# Altium schematic sheet Sheet7.SchDoc
size A
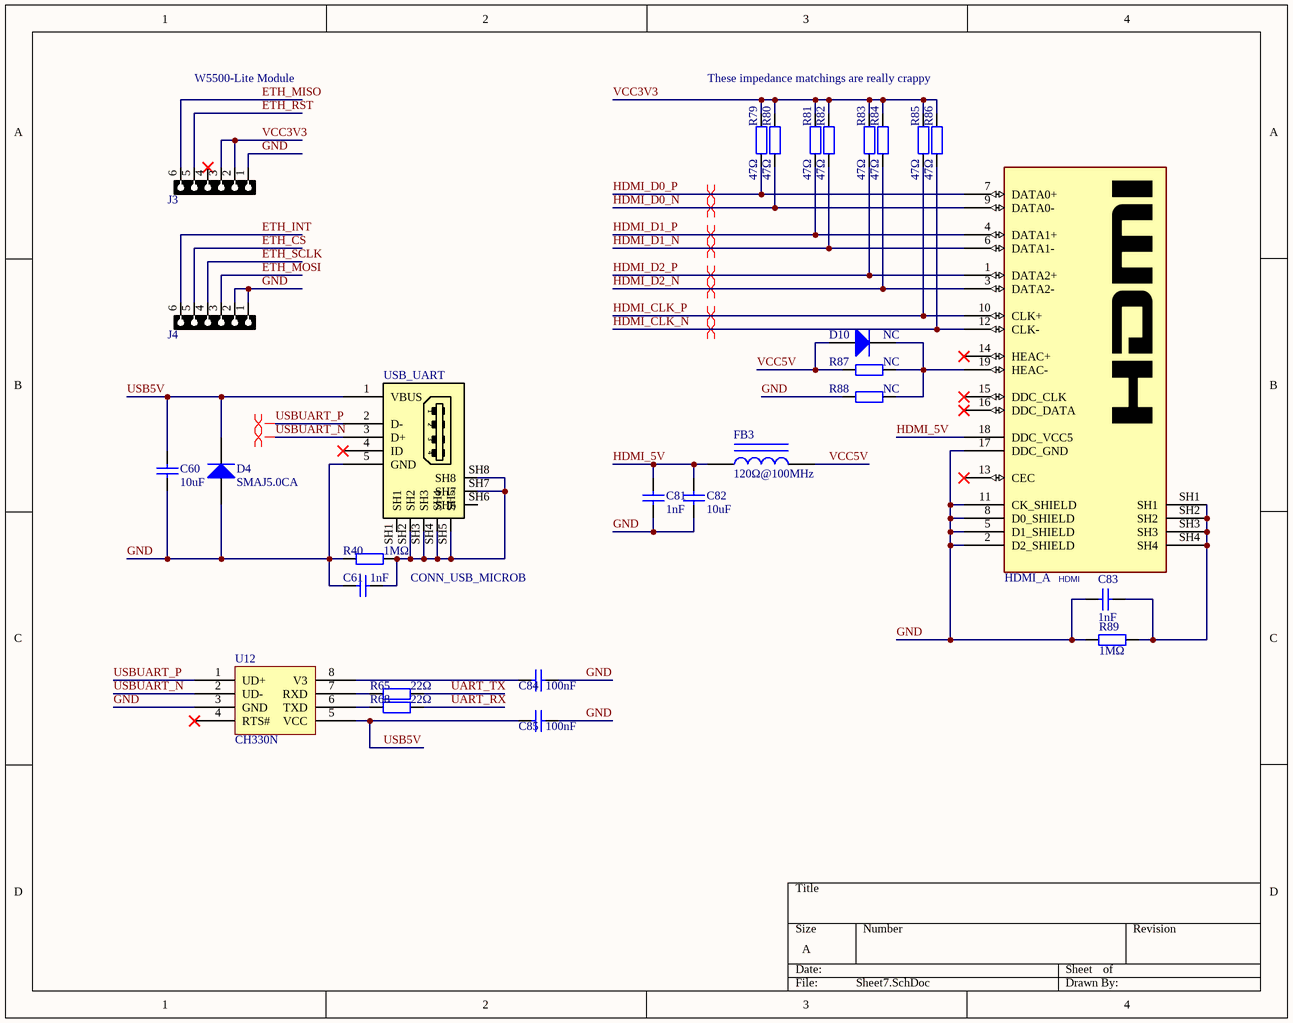
[diagram p0: Sheet7.SchDoc]

## Parts
C60  10uF  [1206_C]
C61  1nF  [0805_C]
C81  1nF  [0805_C]
C82  10uF  [0603_C]
C83  1nF  [0805_C]
C84  100nF  [1206_C]
C85  100nF  [1206_C]
D4  SMAJ5.0CA  [SMA(DO-214AC)_S1]
D10  NC  [SMA(DO-214AC)_S1]
FB3  120Ω@100MHz  [0805_L]
HDMI  HDMI_A  [HDMI_A]
J3  HDRF6  [HDR_F_1X6]  (value not drawn)
J4  HDRF6  [HDR_F_1X6]  (value not drawn)
R40  1MΩ  [0805_R]
R65  22Ω  [1206_R]
R68  22Ω  [1206_R]
R79  47Ω  [0805_R]
R80  47Ω  [0805_R]
R81  47Ω  [0805_R]
R82  47Ω  [0805_R]
R83  47Ω  [0805_R]
R84  47Ω  [0805_R]
R85  47Ω  [0805_R]
R86  47Ω  [0805_R]
R87  NC  [0805_R]
R88  NC  [0805_R]
R89  1MΩ  [0805_R]
U12  CH330N  [SOIC-8_150mil]
USB_UART  CONN_USB_MICROB  [USB_MICRO_B_BM_SHT1]

## Nets
ETH_CS: J4.5
ETH_INT: J4.6
ETH_MISO: J3.6
ETH_MOSI: J4.3
ETH_RST: J3.5
ETH_SCLK: J4.4
GND: C60.1 C61.1 C81.2 C82.1 C83.2 C84.2 C85.2 D4.1(A) HDMI.2(D2_SHIELD) HDMI.5(D1_SHIELD) HDMI.8(D0_SHIELD) HDMI.11(CK_SHIELD) HDMI.17(DDC_GND) J3.1 J4.1 J4.2 R40.1 R88.2 R89.2 U12.3(GND) USB_UART.5(GND)
HDMI_5V: C81.1 C82.2 FB3.1 HDMI.18(DDC_VCC5)
HDMI_CLK_N: HDMI.12(CLK-) R86.1
HDMI_CLK_P: HDMI.10(CLK+) R85.1
HDMI_D0_N: HDMI.9(DATA0-) R80.1
HDMI_D0_P: HDMI.7(DATA0+) R79.1
HDMI_D1_N: HDMI.6(DATA1-) R82.1
HDMI_D1_P: HDMI.4(DATA1+) R81.1
HDMI_D2_N: HDMI.3(DATA2-) R84.1
HDMI_D2_P: HDMI.1(DATA2+) R83.1
UART_RX: R68.2
UART_TX: R65.2
USB5V: C60.2 C85.1 D4.2(K) U12.5(VCC) USB_UART.1(VBUS)
USBUART_N: U12.2(UD-) USB_UART.3(D+)
USBUART_P: U12.1(UD+) USB_UART.2(D-)
VCC3V3: J3.2 J3.3 R79.2 R80.2 R81.2 R82.2 R83.2 R84.2 R85.2 R86.2
VCC5V: D10.1(A) FB3.2 R87.2
NetC61_2: C61.2 R40.2 USB_UART.SH2 USB_UART.SH3 USB_UART.SH4 USB_UART.SH5 USB_UART.SH7 USB_UART.SH8
NetC83_1: C83.1 HDMI.SH1 HDMI.SH2 HDMI.SH3 HDMI.SH4 R89.1
NetC84_1: C84.1 U12.8(V3)
NetD10_2: D10.2(K) HDMI.19(HEAC-) R87.1 R88.1
NetR65_1: R65.1 U12.7(RXD)
NetR68_1: R68.1 U12.6(TXD)

Not connected (* = marked no-connect by the designer): HDMI 13(CEC)* 14(HEAC+)* 15(DDC_CLK)* 16(DDC_DATA)*; J3 4*; U12 4(RTS#)*; USB_UART 4(ID)* SH1 SH6

## Layout directives
differential pair: HDMI_CLK_N, HDMI_CLK_P, HDMI_D0_N, HDMI_D0_P, HDMI_D1_N, HDMI_D1_P, HDMI_D2_N, HDMI_D2_P, USBUART_N, USBUART_P

## Notes on the sheet
- W5500-Lite Module
- These impedance matchings are really crappy

## Library data of the parts
C60 = 1206 10uF (106) 10% 50V: 贴片电容; ComponentLink1Description: 供应商链接; ComponentLink1URL: http://www.szlcsc.com/product/details_14236.html; Package: 1206; Supplier: LC; SuppliersPartNumber: C13585
C61 C81 C83 = 0805 1nF (102) 10% 50V: 贴片电容; ComponentLink1Description: 供应商链接; ComponentLink1URL: http://www.szlcsc.com/product/details_52223.html; Package: 0805; Supplier: LC; SuppliersPartNumber: C51210
C82 = 0603 10uF (106) 10% 10V: 贴片电容; ComponentLink1Description: 供应商链接; ComponentLink1URL: http://www.szlcsc.com/product/details_20411.html; Package: 0603; Supplier: LC; SuppliersPartNumber: C19702
C84 C85 = 1206 100nF (104) 10% 50V: 贴片电容; ComponentLink1Description: 供应商链接; ComponentLink1URL: http://www.szlcsc.com/product/details_25237.html; Package: 1206; Supplier: LC; SuppliersPartNumber: C24497
D4 D10 = SMA(DO-214AC) SS210: 二极管 TVS; ComponentLink1Description: 供应商链接; ComponentLink1URL: http://www.szlcsc.com/product/details_15669.html; Package: SMA(DO-214AC); Supplier: LC; SuppliersPartNumber: C14996
FB3 = 0805 600Ω 25% 100MHz: 贴片磁珠; ComponentLink1Description: 供应商链接; ComponentLink1URL: http://www.szlcsc.com/product/details_1369.html; Package: 0805; Supplier: LC; SuppliersPartNumber: C1017
HDMI = CONN_HDMI_A: CONN, HDMI, Receptacle, TYPE A, 19P, RIGH-ANGLE; MANF: Molex, WURTH; MANF_P#: 47151-0001, 500254-1927, 685119134923; PARAM: Receptacle, 19P, RIGH-ANGLE; PRICE: 2.57$; VALUE: HDMI_A
J3 J4 = HDR_F_1X6: CONN, HEADER, Female, pitch: 2.54mm, 6POS; VALUE: HDRF6
R40 R87-R89 = 0805 1MΩ (1004) 1%: 贴片电阻; ComponentLink1Description: 供应商链接; ComponentLink1URL: http://www.szlcsc.com/product/details_18202.html; Package: 0805; Supplier: LC; SuppliersPartNumber: C17514
R65 R68 = 1206 22Ω (22R0) 1%: 贴片电阻; ComponentLink1Description: 供应商链接; ComponentLink1URL: http://www.szlcsc.com/product/details_18646.html; Package: 1206; Supplier: LC; SuppliersPartNumber: C17958
R79-R86 = 0805 47Ω (47R0) 1%: 贴片电阻; ComponentLink1Description: 供应商链接; ComponentLink1URL: http://www.szlcsc.com/product/details_18402.html; Package: 0805; Supplier: LC; SuppliersPartNumber: C17714
U12 = EEPROM/AT24C256C-SSHL-T_[C6482]: PSRAM, 150mil SOP-8; ComponentLink1Description: 供应商链接; ComponentLink1URL: http://www.szlcsc.com/product/details_6947.html; Package: SOIC-8_150mil; Supplier: LC; SuppliersPartNumber: C6482
USB_UART = CONN_USB_MICRO_B_BM_SHT1: CONN, USB, MICRO B, R/A, SMD, BOTTOM MOUNT, SHT; MANF_P#: 47590-0001; MANF: MOLEX; VALUE: CONN_USB_MICROB